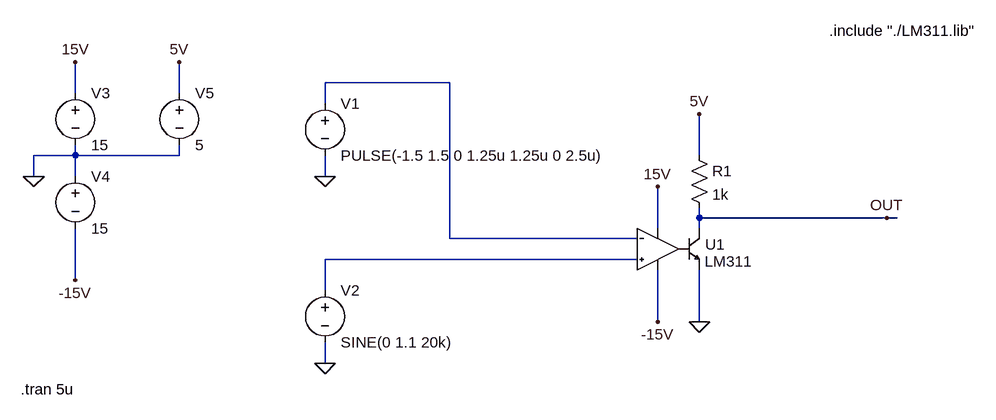
[diagram p0: schematic Delay - Comparador.asc]
Delay - Comparador.asc, the LTspice schematic file:
Version 4
SHEET 1 880 680
WIRE -176 -128 -368 -128
WIRE -752 -112 -752 -160
WIRE -592 -112 -592 -160
WIRE -368 -96 -368 -128
WIRE -752 -16 -752 -32
WIRE -752 -16 -816 -16
WIRE -592 -16 -592 -32
WIRE -592 -16 -752 -16
WIRE 208 -16 208 -80
WIRE -816 16 -816 -16
WIRE -752 16 -752 -16
WIRE -368 16 -368 -16
WIRE 208 80 208 64
WIRE 496 80 208 80
WIRE 512 80 496 80
WIRE 144 96 144 32
WIRE 208 96 208 80
WIRE -176 112 -176 -128
WIRE 112 112 -176 112
WIRE 112 144 -368 144
WIRE -752 176 -752 96
WIRE -368 192 -368 144
WIRE 144 240 144 160
WIRE 208 240 208 160
WIRE -368 304 -368 272
FLAG 208 240 0
FLAG 144 240 -15V
FLAG 144 32 15V
FLAG -816 16 0
FLAG -752 -160 15V
FLAG -752 176 -15V
FLAG -368 16 0
FLAG -368 304 0
FLAG 208 -80 5V
FLAG 496 80 OUT
FLAG -592 -160 5V
SYMBOL voltage -368 -112 R0
WINDOW 123 0 0 Left 0
WINDOW 39 0 0 Left 0
SYMATTR InstName V1
SYMATTR Value PULSE(-1.5 1.5 0 1.25u 1.25u 0 2.5u)
SYMBOL voltage -368 176 R0
WINDOW 123 0 0 Left 0
WINDOW 39 0 0 Left 0
SYMATTR InstName V2
SYMATTR Value SINE(0 1.1 20k)
SYMBOL voltage -752 -128 R0
WINDOW 123 0 0 Left 0
WINDOW 39 0 0 Left 0
SYMATTR InstName V3
SYMATTR Value 15
SYMBOL voltage -752 0 R0
WINDOW 123 0 0 Left 0
WINDOW 39 0 0 Left 0
SYMATTR InstName V4
SYMATTR Value 15
SYMBOL res 192 -32 R0
SYMATTR InstName R1
SYMATTR Value 1k
SYMBOL voltage -592 -128 R0
WINDOW 123 0 0 Left 0
WINDOW 39 0 0 Left 0
SYMATTR InstName V5
SYMATTR Value 5
SYMBOL LM311 144 128 R0
SYMATTR InstName U1
TEXT -836 344 Left 2 !.tran 5u
TEXT 408 -208 Left 2 !.include "./LM311.lib"

The netlist it stands for:
* Delay - Comparador.asc
V1 N001 0 PULSE(-1.5 1.5 0 1.25u 1.25u 0 2.5u)
V2 N002 0 SINE(0 1.1 20k)
V3 15V 0 15
V4 0 -15V 15
R1 5V OUT 1k
V5 5V 0 5
XU1 N002 N001 15V -15V OUT 0 LM311  ; pins 1 2 3 4 5 6
.tran 5u
.include "./LM311.lib"
.backanno
.end